# Altium schematic sheet 3_SurvBot_RCU_MotorControl.SchDoc
size A3; SheetNumber: 4; SheetTotal: 8
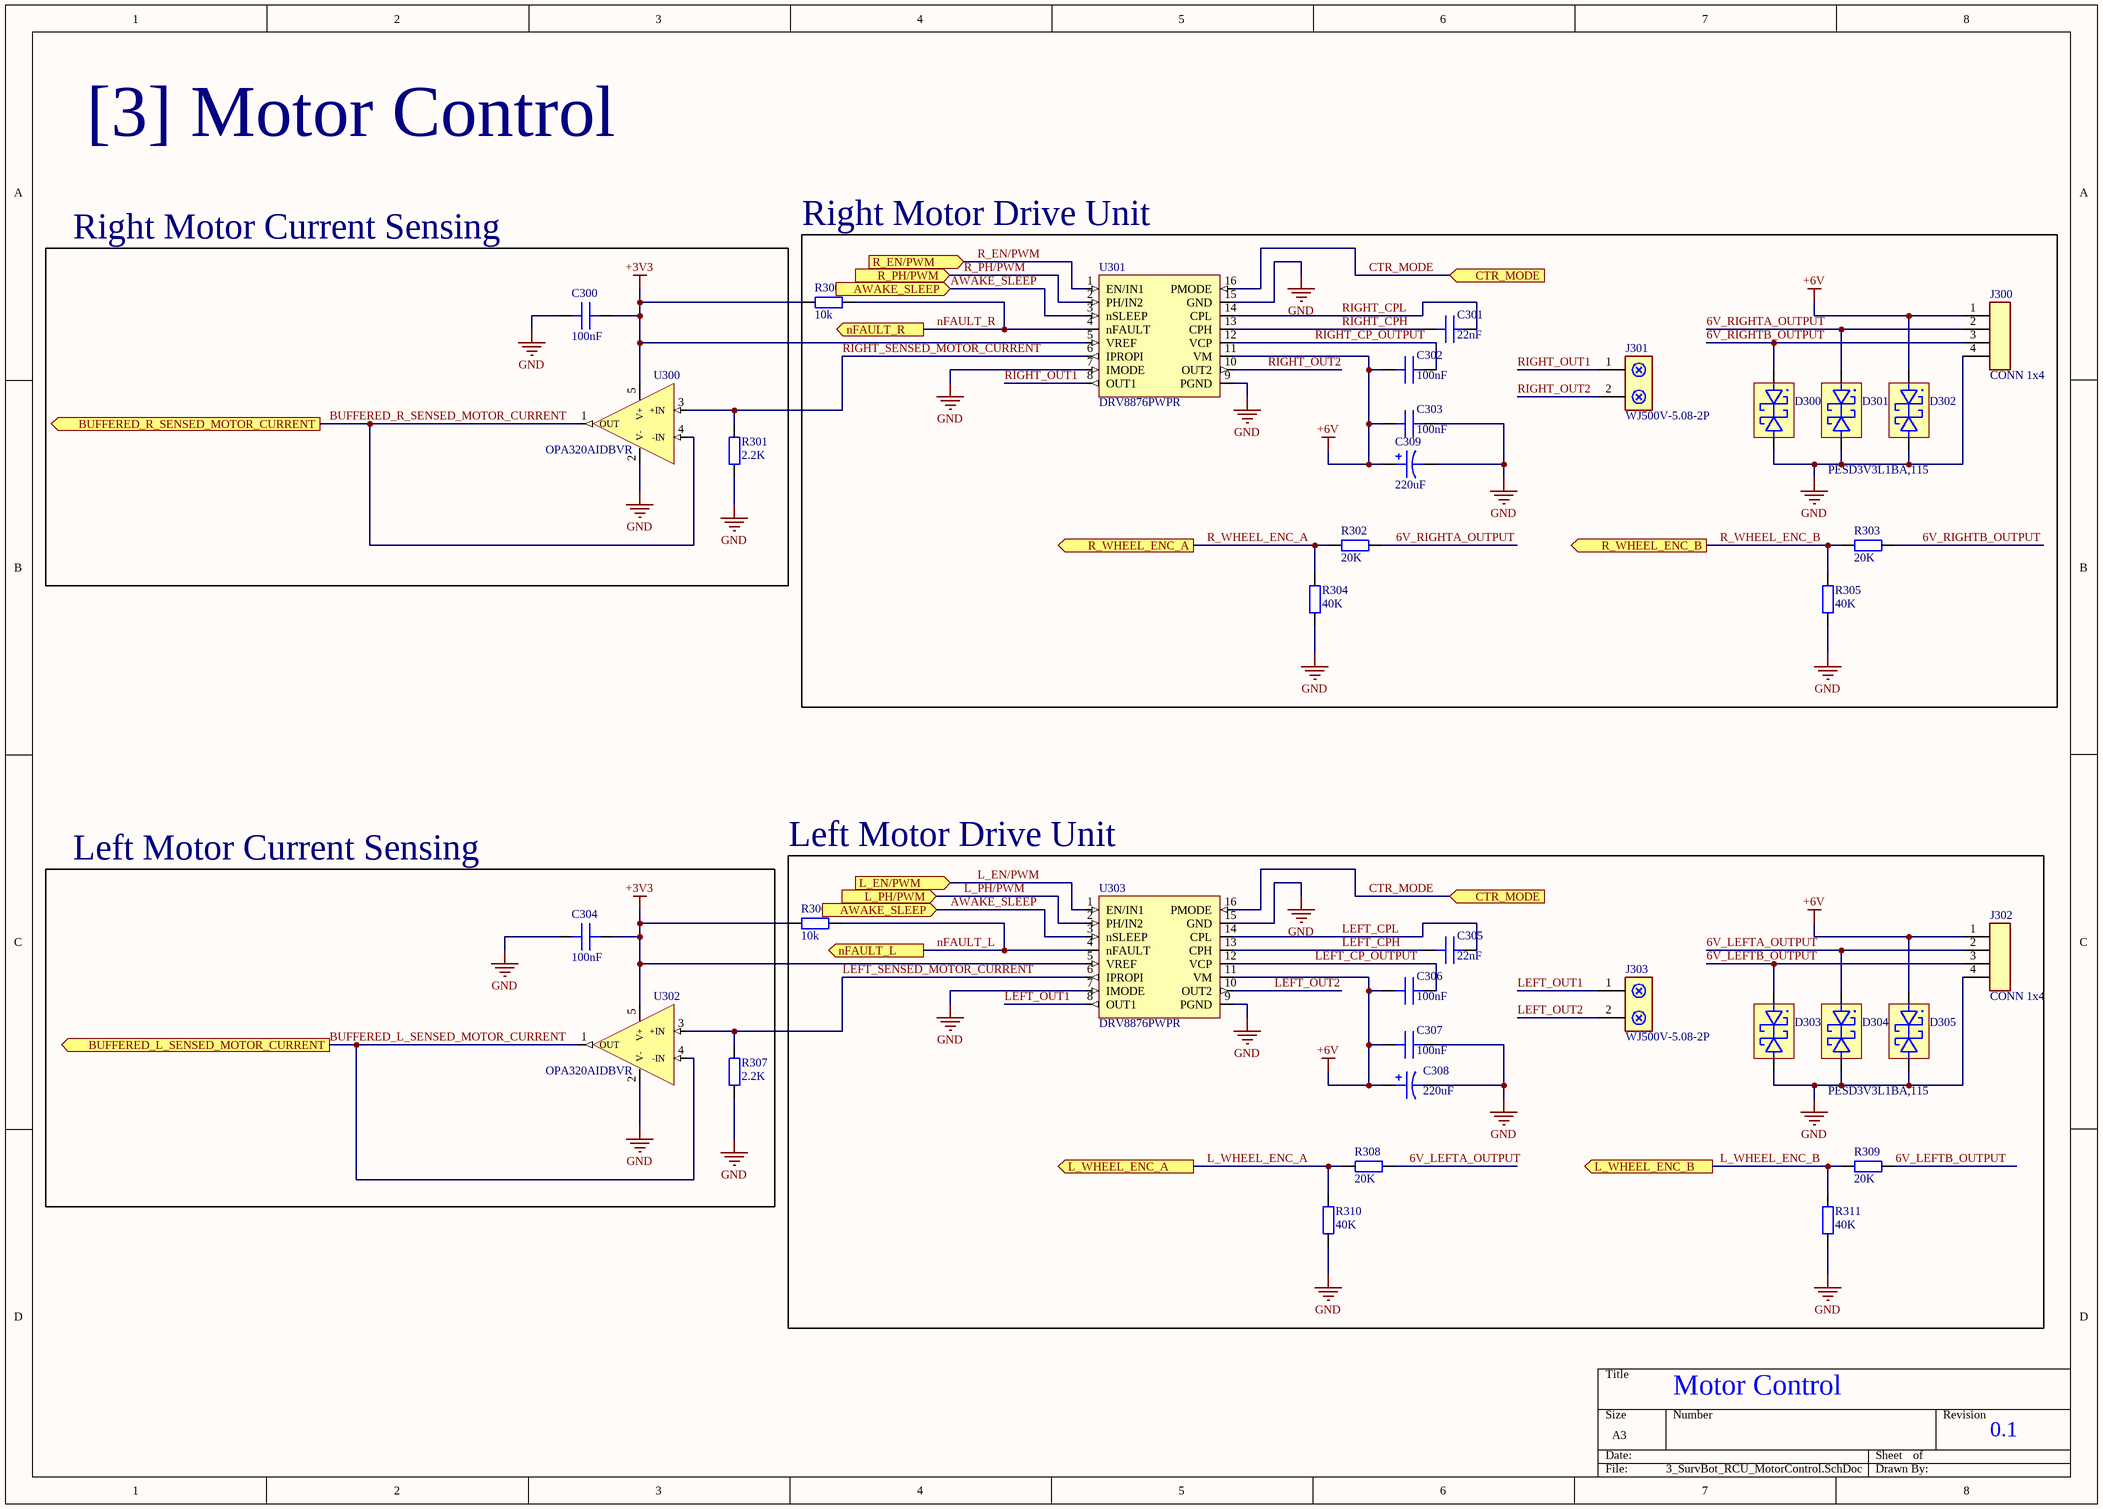
[diagram p0: 3_SurvBot_RCU_MotorControl.SchDoc]

## Parts
C300  100nF  [CAP_0603]
C301  22nF  [CAP_0603]
C302  100nF  [CAP_0603]
C303  100nF  [CAP_0603]
C304  100nF  [CAP_0603]
C305  22nF  [CAP_0603]
C306  100nF  [CAP_0603]
C307  100nF  [CAP_0603]
C308  220uF  [CAP-THT-Radial__D8.0mmP3.5mm]
C309  220uF  [CAP-THT-Radial__D8.0mmP3.5mm]
D300  PESD3V3L1BA,115  [SC-76, SOD-323]  (value not drawn)
D301  PESD3V3L1BA,115  [SC-76, SOD-323]  (value not drawn)
D302  PESD3V3L1BA,115  [SC-76, SOD-323]  (value not drawn)
D303  PESD3V3L1BA,115  [SC-76, SOD-323]  (value not drawn)
D304  PESD3V3L1BA,115  [SC-76, SOD-323]  (value not drawn)
D305  PESD3V3L1BA,115  [SC-76, SOD-323]  (value not drawn)
J300  CONN 1x4  [2541FV-4P]
J301  WJ500V-5.08-2P  [WJ500V-5.08-2P]
J302  CONN 1x4  [2541FV-4P]
J303  WJ500V-5.08-2P  [WJ500V-5.08-2P]
R300  10k  [RES_0402]
R301  2.2K  [RES_0603]
R302  20K  [RES_0603]
R303  20K  [RES_0603]
R304  40K  [RES_0603]
R305  40K  [RES_0603]
R306  10k  [RES_0402]
R307  2.2K  [RES_0603]
R308  20K  [RES_0603]
R309  20K  [RES_0603]
R310  40K  [RES_0603]
R311  40K  [RES_0603]
U300  OPA320AIDBVR  [SOT-23-5]
U301  DRV8876PWPR  [16-HTSSOP]
U302  OPA320AIDBVR  [SOT-23-5]
U303  DRV8876PWPR  [16-HTSSOP]

## Blocks framed on the sheet
Right Motor Drive Unit: C301-C303 C309 D300-D302 J300 J301 R300 R302-R305 U301
Right Motor Current Sensing: C300 R301 U300
Left Motor Current Sensing: C304 R307 U302
Left Motor Drive Unit: C305-C308 D303-D305 J302 J303 R306 R308-R311 U303

## Ports
AWAKE_SLEEP (in, see 0_SurvBot_RCU_Overview[3B], 2_SurvBot_RCU_MCU[4B]), BUFFERED_L_SENSED_MOTOR_CURRENT (out, see 0_SurvBot_RCU_Overview[4B], 6_SurvBot_RCU_CurrentFeedback[3C]), BUFFERED_R_SENSED_MOTOR_CURRENT (out, see 0_SurvBot_RCU_Overview[4B], 6_SurvBot_RCU_CurrentFeedback[3B]), CTR_MODE (in, see 0_SurvBot_RCU_Overview[3C], 2_SurvBot_RCU_MCU[4B]), L_EN/PWM (in, see 0_SurvBot_RCU_Overview[3B], 2_SurvBot_RCU_MCU[4A]), L_PH/PWM (in, see 0_SurvBot_RCU_Overview[3B], 2_SurvBot_RCU_MCU[3B]), L_WHEEL_ENC_A (out, see 0_SurvBot_RCU_Overview[3B], 2_SurvBot_RCU_MCU[3B]), L_WHEEL_ENC_B (out, see 0_SurvBot_RCU_Overview[3B], 2_SurvBot_RCU_MCU[3B]), nFAULT_L (out, see 0_SurvBot_RCU_Overview[3B], 2_SurvBot_RCU_MCU[4A]), nFAULT_R (out, see 0_SurvBot_RCU_Overview[3B], 2_SurvBot_RCU_MCU[4B]), R_EN/PWM (in, see 0_SurvBot_RCU_Overview[3B], 2_SurvBot_RCU_MCU[3B]), R_PH/PWM (in, see 0_SurvBot_RCU_Overview[3B], 2_SurvBot_RCU_MCU[3B]), R_WHEEL_ENC_A (out, see 0_SurvBot_RCU_Overview[3B], 2_SurvBot_RCU_MCU[3B]), R_WHEEL_ENC_B (out, see 0_SurvBot_RCU_Overview[3B], 2_SurvBot_RCU_MCU[3B])

## Nets
+3V3: C300.1 C304.1 R300.1 R306.1 U300.5(V+) U301.5(VREF) U302.5(V+) U303.5(VREF)
+6V: C302.2 C303.2 C306.2 C307.2 C308.1 C309.1 D302.K1 D305.K1 J300.1 J302.1 U301.11(VM) U303.11(VM)
GND: C300.2 C303.1 C304.2 C307.1 C308.2 C309.2 D300.K2 D301.K2 D302.K2 D303.K2 D304.K2 D305.K2 J300.4 J302.4 R301.1 R304.1 R305.1 R307.1 R310.1 R311.1 U300.2(V-) U301.7(IMODE) U301.9(PGND) U301.15(GND) U302.2(V-) U303.7(IMODE) U303.9(PGND) U303.15(GND)
6V_LEFTA_OUTPUT: D304.K1 J302.2 R308.2
6V_LEFTB_OUTPUT: D303.K1 J302.3 R309.2
6V_RIGHTA_OUTPUT: D301.K1 J300.2 R302.2
6V_RIGHTB_OUTPUT: D300.K1 J300.3 R303.2
AWAKE_SLEEP: U301.3(nSLEEP) U303.3(nSLEEP) ; port AWAKE_SLEEP
BUFFERED_L_SENSED_MOTOR_CURRENT: U302.1(OUT) U302.4(-IN) ; port BUFFERED_L_SENSED_MOTOR_CURRENT
BUFFERED_R_SENSED_MOTOR_CURRENT: U300.1(OUT) U300.4(-IN) ; port BUFFERED_R_SENSED_MOTOR_CURRENT
CTR_MODE: U301.16(PMODE) U303.16(PMODE) ; port CTR_MODE
L_EN/PWM: U303.1(EN/IN1) ; port L_EN/PWM
L_PH/PWM: U303.2(PH/IN2) ; port L_PH/PWM
L_WHEEL_ENC_A: R308.1 R310.2 ; port L_WHEEL_ENC_A
L_WHEEL_ENC_B: R309.1 R311.2 ; port L_WHEEL_ENC_B
LEFT_CP_OUTPUT: C306.1 U303.12(VCP)
LEFT_CPH: C305.1 U303.13(CPH)
LEFT_CPL: C305.2 U303.14(CPL)
LEFT_OUT1: J303.1 U303.8(OUT1)
LEFT_OUT2: J303.2 U303.10(OUT2)
LEFT_SENSED_MOTOR_CURRENT: R307.2 U302.3(+IN) U303.6(IPROPI)
nFAULT_L: R306.2 U303.4(nFAULT) ; port nFAULT_L
nFAULT_R: R300.2 U301.4(nFAULT) ; port nFAULT_R
R_EN/PWM: U301.1(EN/IN1) ; port R_EN/PWM
R_PH/PWM: U301.2(PH/IN2) ; port R_PH/PWM
R_WHEEL_ENC_A: R302.1 R304.2 ; port R_WHEEL_ENC_A
R_WHEEL_ENC_B: R303.1 R305.2 ; port R_WHEEL_ENC_B
RIGHT_CP_OUTPUT: C302.1 U301.12(VCP)
RIGHT_CPH: C301.1 U301.13(CPH)
RIGHT_CPL: C301.2 U301.14(CPL)
RIGHT_OUT1: J301.1 U301.8(OUT1)
RIGHT_OUT2: J301.2 U301.10(OUT2)
RIGHT_SENSED_MOTOR_CURRENT: R301.2 U300.3(+IN) U301.6(IPROPI)

## Notes on the sheet
- [3] Motor Control
- PESD3V3L1BA,115
- Motor Control
- 0.1

## Library data of the parts
C300 C302-C304 C306 C307 = CAP_100nF-50V-10%-0603: 0.1 µF ±10% 50V Ceramic Capacitor X7R 0603 (1608 Metric); Manufacturer: KEMET; Manufacturer Part #: C0603C104K5RACAUTO; Case/Package: 0603; Supplier: JLCPCB; Supplier Part #: C129621
C301 C305 = CAP_22nF_100V-10%-0603: 0.022 µF ±10% 100V Ceramic Capacitor X7R 0603 (1608 Metric); Manufacturer: Murata Electronics; Manufacturer Part #: GCM188R72A223KA37D; Case/Package: 0603; Supplier: JLCPCB; Supplier Part #: C161234
C308 C309 = CAP_220uF-35V-20%_RADIAL-TH: 220 µF 35 V Aluminum Electrolytic Capacitors Radial, Can 8000 Hrs @ 105°C; Manufacturer: Rubycon; Manufacturer Part #: 35ZLH220MEFC8X11.5; Case/Package: TH,D8xL11.5mm; Supplier: JLCPCB; Supplier Part #: C107639
D300-D305 = DIO-TVS_3.3V-26V-18A-SOD-323: 26V Clamp 18A (8/20µs) Ipp Tvs Diode Surface Mount SOD-323; Manufacturer: Nexperia; Manufacturer Part #: PESD3V3L1BA,115; Case/Package: SOD-323; Supplier: JLCPCB; Supplier Part #: C51450
J300 J302 = CONN_4_HDR_0.1-2541FV-4P: 2.54mm 3A Single Row 4P -40℃~+105℃ 250V Direct Insert 1x4P Top Square Hole Plugin,P=2.54mm Female Headers ROHS; Manufacturer: HanElectricity; Manufacturer Part #: 2541FV-4P; Case/Package: P=2.54mm; Supplier: JLCPCB; Supplier Part #: C18723049
J301 J303 = Terminal_Screw_5.08mm_2P: 1x2P 5.08mm 2.5 1 2 18A -40℃~+105℃ 250V Green 14~30 Direct Insert Plugin,P=5.08mm Screw Terminal Blocks ROHS; Manufacturer: Ningbo Kangnex Elec; Manufacturer Part #: WJ500V-5.08-2P; Case/Package: P=5.08mm; Supplier: JLCPCB; Supplier Part #: C8465
R300 R306 = RES_10K-62.5mW-1%-0402: 10 kOhms ±1% 0.063W, 1/16W Chip Resistor 0402 (1005 Metric) Moisture Resistant Thick Film; Manufacturer: YAGEO; Manufacturer Part #: RC0402FR-0710KL; Case/Package: 0402; Supplier: JLCPCB; Supplier Part #: C60490
R301 R307 = RES_2.2K-100mW-1%-0603: 2.2 kOhms ±1% 0.1W, 1/10W Chip Resistor 0603 (1608 Metric) Moisture Resistant Thick Film; Manufacturer: YAGEO; Manufacturer Part #: RC0603FR-072K2L; Case/Package: 0603; Supplier: JLCPCB; Supplier Part #: C114662
R302 R303 R308 R309 = RES_20K-100mW-1%-0603: 20 kOhms ±1% 0.1W, 1/10W Chip Resistor 0603 (1608 Metric) Automotive AEC-Q200 Thick Film; Manufacturer: PANASONIC; Manufacturer Part #: ERJ-3EKF2002V; Case/Package: 0603; Supplier: JLCPCB; Supplier Part #: C403057
R304 R305 R310 R311 = RES_40K_100mW-1%-0603: 40 kOhms ±0.1% 0.1W, 1/10W Chip Resistor 0603 (1608 Metric) Anti-Sulfur, Automotive AEC-Q200, Moisture Resistant Thin Film; Manufacturer: YAGEO; Manufacturer Part #: AT0603BRD0740KL; Case/Package: 0603; Supplier: JLCPCB; Supplier Part #: C5455515
U300 U302 = OPAMP-OPA320_R2R_SOT23-5: General Purpose Amplifier 1 Circuit Rail-to-Rail SOT-23-5; Manufacturer: Texas Instruments; Manufacturer Part #: OPA320AIDBVR; Case/Package: SOT-23-5; Supplier: JLCPCB; Supplier Part #: C92494
U301 U303 = MTRDRV-DRV8876-HBridge_4.5-37V_3.5A: DRV8876 H-Bridge Motor Driver With Integrated Current Sense and Regulation 16-HTSSOP; Manufacturer: Texas Instruments; Manufacturer Part #: DRV8876PWPR; Case/Package: HTSSOP-16-EP; Supplier: JLCPCB; Supplier Part #: C575551